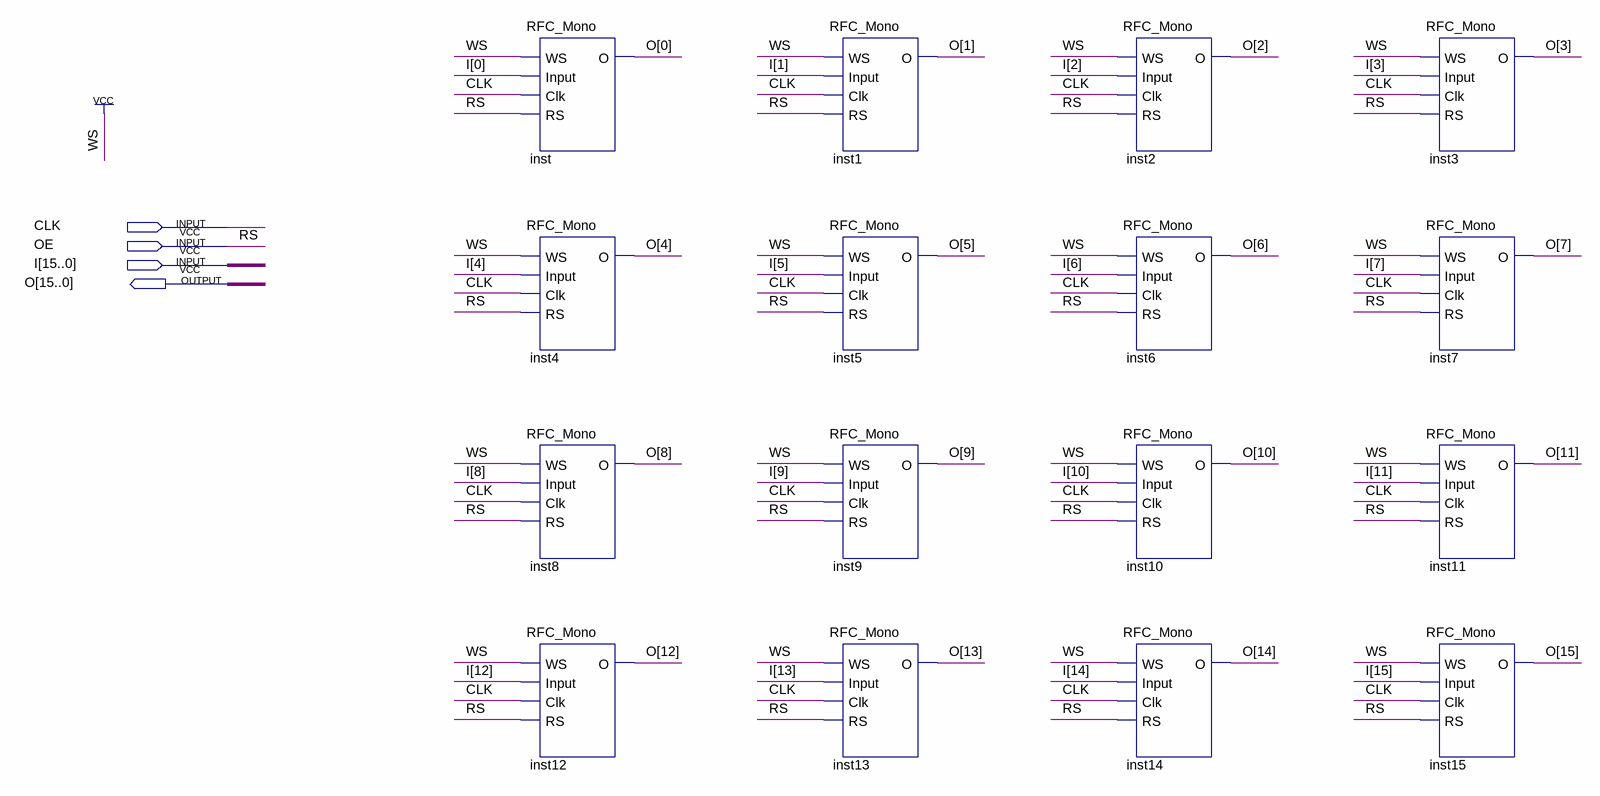
[diagram p0: schematic sheet]
// Quartus schematic REG16.bdf as structural Verilog: 16 symbols, 4 pins
module REG16 (
  input  CLK,
  input  OE,
  input  [15:0] I,
  output [15:0] O
);

  RFC_Mono inst (.WS(1'b1), .Input(I[0]), .Clk(CLK), .RS(OE), .O(O[0]));
  RFC_Mono inst4 (.WS(1'b1), .Input(I[4]), .Clk(CLK), .RS(OE), .O(O[4]));
  RFC_Mono inst8 (.WS(1'b1), .Input(I[8]), .Clk(CLK), .RS(OE), .O(O[8]));
  RFC_Mono inst12 (.WS(1'b1), .Input(I[12]), .Clk(CLK), .RS(OE), .O(O[12]));
  RFC_Mono inst1 (.WS(1'b1), .Input(I[1]), .Clk(CLK), .RS(OE), .O(O[1]));
  RFC_Mono inst5 (.WS(1'b1), .Input(I[5]), .Clk(CLK), .RS(OE), .O(O[5]));
  RFC_Mono inst9 (.WS(1'b1), .Input(I[9]), .Clk(CLK), .RS(OE), .O(O[9]));
  RFC_Mono inst13 (.WS(1'b1), .Input(I[13]), .Clk(CLK), .RS(OE), .O(O[13]));
  RFC_Mono inst2 (.WS(1'b1), .Input(I[2]), .Clk(CLK), .RS(OE), .O(O[2]));
  RFC_Mono inst6 (.WS(1'b1), .Input(I[6]), .Clk(CLK), .RS(OE), .O(O[6]));
  RFC_Mono inst10 (.WS(1'b1), .Input(I[10]), .Clk(CLK), .RS(OE), .O(O[10]));
  RFC_Mono inst14 (.WS(1'b1), .Input(I[14]), .Clk(CLK), .RS(OE), .O(O[14]));
  RFC_Mono inst3 (.WS(1'b1), .Input(I[3]), .Clk(CLK), .RS(OE), .O(O[3]));
  RFC_Mono inst7 (.WS(1'b1), .Input(I[7]), .Clk(CLK), .RS(OE), .O(O[7]));
  RFC_Mono inst11 (.WS(1'b1), .Input(I[11]), .Clk(CLK), .RS(OE), .O(O[11]));
  RFC_Mono inst15 (.WS(1'b1), .Input(I[15]), .Clk(CLK), .RS(OE), .O(O[15]));

  // Other names for the same wires on the sheet: RS = OE
endmodule
